# Altium schematic sheet 7_Temp.SchDoc
size A4; SheetNumber: 10; SheetTotal: 12
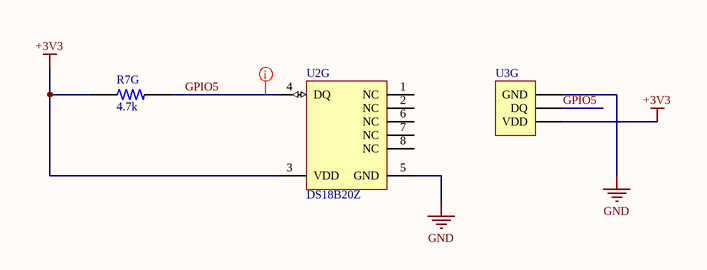
[diagram p0: 7_Temp.SchDoc]

## Parts
R7G  4.7k  [R-0603]
U2G  DS18B20Z  [MAXM-S8-2_N]
U3G  Header 3  [HDR1X3]  (value not drawn)

## Nets
+3V3: R7G.1 U2G.3(VDD) U3G.3(VDD)
GND: U2G.5(GND) U3G.1(GND)
GPIO5: R7G.2 U2G.4(DQ) U3G.2(DQ)

Not connected (* = marked no-connect by the designer): U2G 1(NC) 2(NC) 6(NC) 7(NC) 8(NC)

## Layout directives
net class Signal_50ohm: GPIO5

## Library data of the parts
R7G = R-0603: 0603; MP: 2-1623703-0; Power_Rating: .1 W; Value: 10K; Tolerance: 1%; MF: TE Connectivity; Package: 0603; Price: None; Resistance: 10K; Check_prices: https://www.snapeda.com/parts/2-1623703-0/TE%20Connectivity/view-part/2213192/?ref=eda; SnapEDA_Link: https://www.snapeda.com/parts/2-1623703-0/TE%20Connectivity/view-part/2213192/?ref=snap; Availability: Warning
U2G = CMP-0253-00023-2: High-Precision 1-Wire Digital Thermometer, -55 to 125 degC, 8-Pin SOIC (S8-2); Parasite Pwr.: Yes; Temp. Thresh.: Programmable (NV); Sensor Type: Local; Code_JEDEC: MS012; Mounting Technology: Surface Mount; ComponentLink3Description: Package Specification; PartNumber: DS18B20Z; ComponentLink2Description: Datasheet; ComponentLink3URL: http://pdfserv.maximintegrated.com/package_dwgs/21-0041.PDF; PackageVersion: Rev. D, 10/2012; ComponentLink1URL: http://www.maximintegrated.com/; Multi Droppable: Yes; ComponentLink1Description: Manufacturer URL; ComponentLink2URL: http://datasheets.maximintegrated.com/en/ds/DS18B20.pdf; Generic Part Number: DS18B20; PackageReference: S8-2; PackageDescription: 8-Pin Small-Outline IC, Narrow (0.15in) (S8-2), Body 4.90 x 3.90 mm, Pitch 1.27 mm; Interface: 1-Wire; DatasheetVersion: Rev. 4
U3G = Header 3: Header, 3-Pin; LatestRevisionDate: 17-Jul-2002; LatestRevisionNote: Re-released for DXP Platform.; Publisher: Altium Limited